# Altium project DAL_OBC_V11PrjPcb.PrjPcb (part 7 of 9)

## Sheet WATCHDOG.SchDoc
size 420 x 297 mm; SheetNumber: 20; SheetTotal: 34
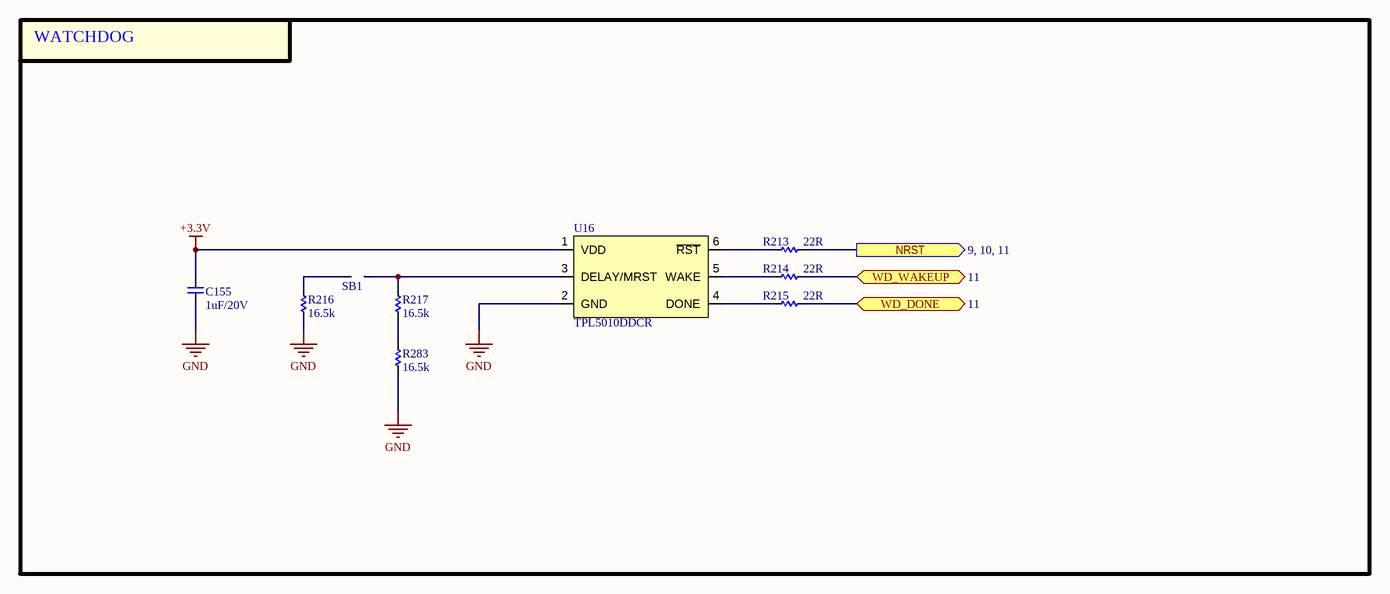
[diagram p18: WATCHDOG.SchDoc]

### Parts
C155  1uF/20V  [CAP_C_1005X50_L]
R213  22R  [RES_C_1005x30_L]
R214  22R  [RES_C_1005x30_L]
R215  22R  [RES_C_1005x30_L]
R216  16.5k  [RES_C_1005x30_L]
R217  16.5k  [RES_C_1005x30_L]
R283  16.5k  [RES_C_1005x30_L]
SB1  JUMPER  [JUMPER_1608]  (value not drawn)
U16  TPL5010DDCR  [TPL5010DDCR]

### Blocks framed on the sheet
WATCHDOG: C155 R213-R217 R283 SB1 U16

### Ports
NRST (out, see 9, 10, 11), WD_DONE (bidir, see 11), WD_WAKEUP (bidir, see 11)

### Nets
+3.3V: C155.2 U16.1(VDD)
GND: C155.1 R216.2 R283.2 U16.2(GND)  [project net AGND]
NetC75_2: R213.2 ; port NRST
NetR67_1: R214.2 ; port WD_WAKEUP
NetR111_1: R215.2 ; port WD_DONE
NetR213_1: R213.1 U16.6(~{RST})
NetR214_1: R214.1 U16.5(WAKE)
NetR215_1: R215.1 U16.4(DONE)
NetR216_1: R216.1 SB1.1
NetR217_1: R217.1 SB1.2 U16.3(DELAY/MRST)
NetR217_2: R217.2 R283.1

### Notes on the sheet
- Project:
- Sub-system:
- Design by:
- Sheet title:
- Sheet
- of
- Checked by:
- Approved by:
- Revision:
- Document No:
- Size:
- Date:
- A3

### Library data of the parts
C155 = _CAP_C_2: CAP CHIP
R213-R217 R283 = _RES_B_2: RES
U16 = TPL5010DDCR: OSC PROG TIMER TSOT23-6

## Sheet CAN_PHY.SchDoc
size 420 x 297 mm; SheetNumber: 21; SheetTotal: 34
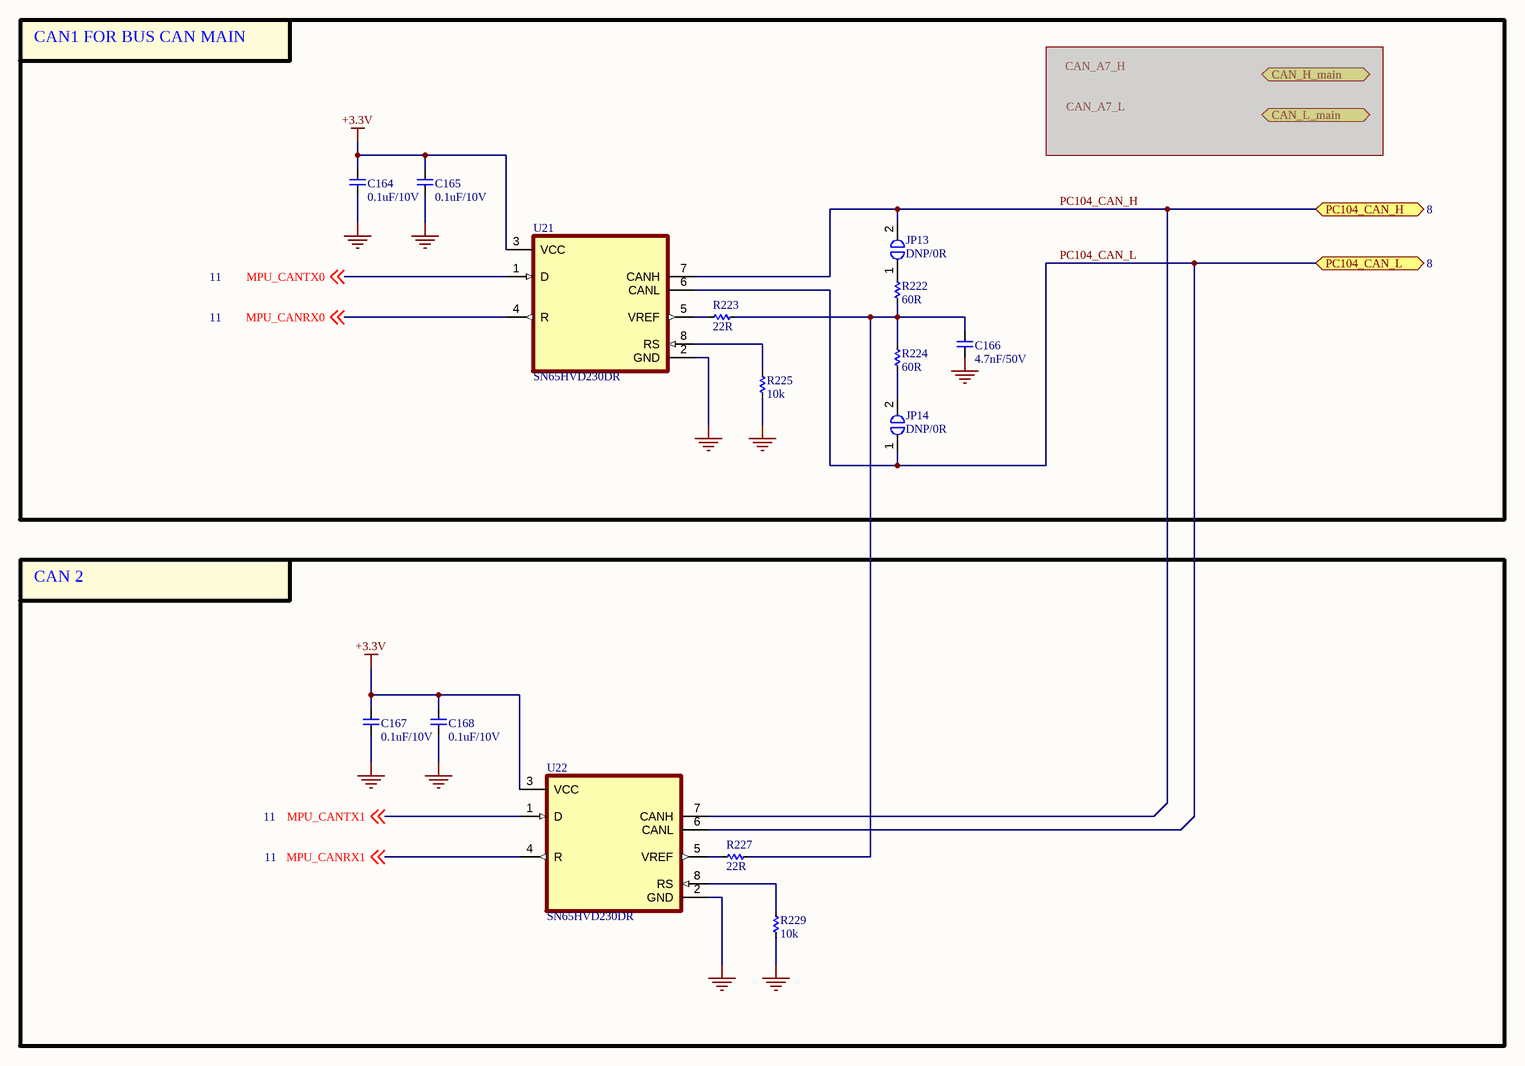
[diagram p19: CAN_PHY.SchDoc]

### Parts
C164  0.1uF/10V  [CAP_C_1005X50_L]
C165  0.1uF/10V  [CAP_C_1005X50_L]
C166  4.7nF/50V  [CAP_C_1608X80]
C167  0.1uF/10V  [CAP_C_1005X50_L]
C168  0.1uF/10V  [CAP_C_1005X50_L]
JP13  DNP/0R  [RES_C_1608X60]
JP14  DNP/0R  [RES_C_1608X60]
R222  60R  [RES_C_1005x30_L]
R223  22R  [RES_C_1005x30_L]
R224  60R  [RES_C_1005x30_L]
R225  10k  [RES_C_1005x30_L]
R227  22R  [RES_C_1005x30_L]
R229  10k  [RES_C_1005x30_L]
U21  SN65HVD230DR  [SOIC127P602X173-8N]
U22  SN65HVD230DR  [SOIC127P602X173-8N]

### Blocks framed on the sheet
CAN1 FOR BUS CAN MAIN: C164-C166 JP13 JP14 R222-R225 U21
CAN 2: C167 C168 R227 R229 U22

### Ports
CAN_H_main (bidir, see CAN_PHY[5A], CONNECTOR_EXP[4B], CONNECTOR_INTERFACE[4A]), CAN_L_main (bidir, see CAN_PHY[5A], CONNECTOR_EXP[4B], CONNECTOR_INTERFACE[4A]), PC104_CAN_H (bidir, see 8), PC104_CAN_L (bidir, see 8)

### Nets
+3.3V: C164.2 C165.2 C167.2 C168.2 U21.3(VCC) U22.3(VCC)
GND: C164.1 C165.1 C166.1 C167.1 C168.1 R225.2 R229.2 U21.2(GND) U22.2(GND)  [project net AGND]
MPU_CANRX0: U21.4(R) ; off-sheet MPU_CANRX0
MPU_CANRX1: U22.4(R) ; off-sheet MPU_CANRX1
MPU_CANTX0: U21.1(D) ; off-sheet MPU_CANTX0
MPU_CANTX1: U22.1(D) ; off-sheet MPU_CANTX1
PC104_CAN_H: JP13.2 U21.7(CANH) U22.7(CANH) ; port PC104_CAN_H
PC104_CAN_L: JP14.1 U21.6(CANL) U22.6(CANL) ; port PC104_CAN_L
NetC166_2: C166.2 R222.2 R223.1 R224.1 R227.1
NetJP13_1: JP13.1 R222.1
NetJP14_2: JP14.2 R224.2
NetR223_2: R223.2 U21.5(VREF)
NetR225_1: R225.1 U21.8(RS)
NetR227_2: R227.2 U22.5(VREF)
NetR229_1: R229.1 U22.8(RS)

### Notes on the sheet
- Project:
- Sub-system:
- Design by:
- Sheet title:
- Sheet
- of
- Checked by:
- Approved by:
- Revision:
- Document No:
- Size:
- Date:
- A3

### Library data of the parts
C164-C168 = _CAP_C_2: CAP
JP13 JP14 = JUMPER_1_1
R222-R225 R227 R229 = _RES_B_2: RES
U21 U22 = SN65HVD230DR: 3.3 V CAN Transceiver with Standby Mode; MF: Texas Instruments; SnapEDA_Link: https://www.snapeda.com/parts/SN65HVD230DR/Texas+Instruments/view-part/?ref=snap; Package: SOIC-8 Texas Instruments; Value: *; MP: SN65HVD230DR; Check_prices: https://www.snapeda.com/parts/SN65HVD230DR/Texas+Instruments/view-part/?ref=eda

## Sheet RS485.SchDoc
size 420 x 297 mm; SheetNumber: 22; SheetTotal: 34
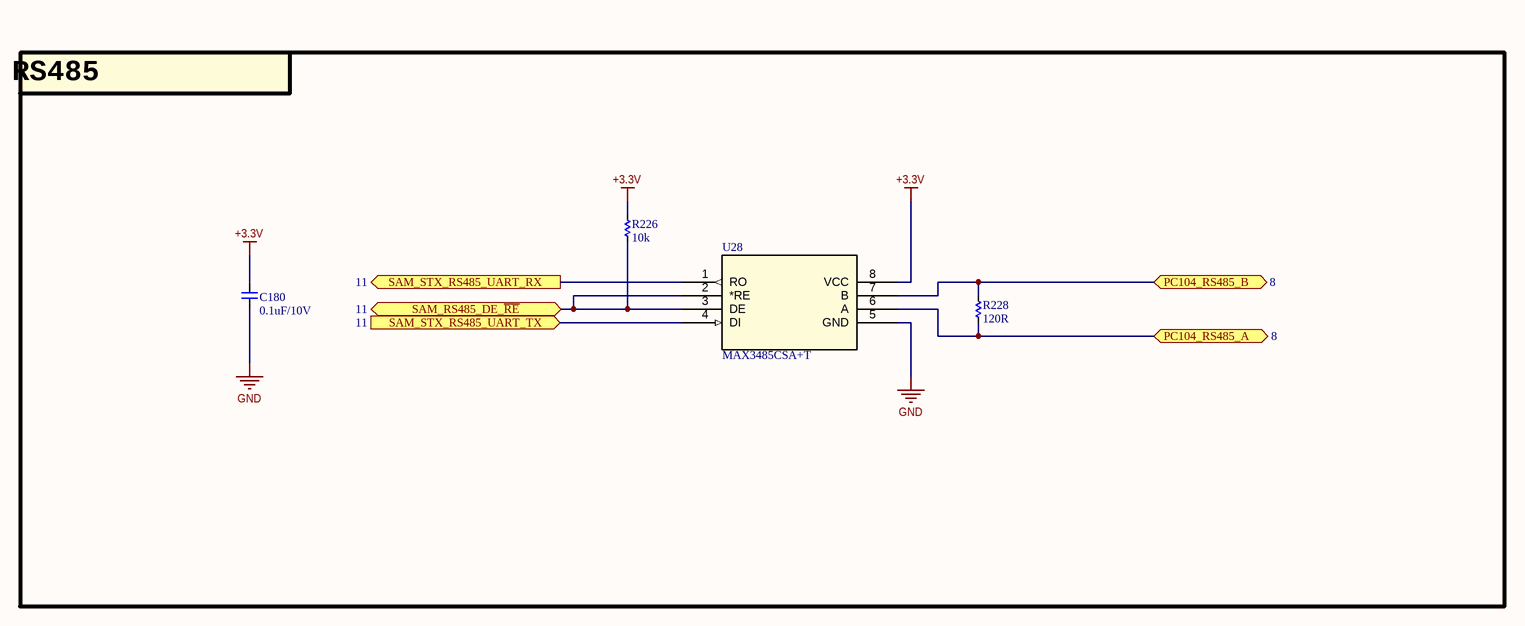
[diagram p20: RS485.SchDoc]

### Parts
C180  0.1uF/10V  [CAP_C_1005X50_L]
R226  10k  [RES_C_1005x30_L]
R228  120R  [RES_C_1005x30_L]
U28  MAX3485CSA+T  [21-0041-3-M_90-0096-8L_MXM]

### Blocks framed on the sheet
RS485: C180 R226 R228 U28

### Ports
PC104_RS485_A (bidir, see 8), PC104_RS485_B (bidir, see 8), SAM_RS485_DE_~{RE} (bidir, see 11), SAM_STX_RS485_UART_RX (out, see 11), SAM_STX_RS485_UART_TX (in, see 11)

### Nets
+3.3V: C180.2 R226.1 U28.8(VCC)
GND: C180.1 U28.5(GND)  [project net AGND]
NetH1_37: R228.1 U28.7(B) ; port PC104_RS485_B
NetH1_38: R228.2 U28.6(A) ; port PC104_RS485_A
NetR48_1: U28.4(DI) ; port SAM_STX_RS485_UART_TX
NetR51_1: U28.1(RO) ; port SAM_STX_RS485_UART_RX
NetR226_2: R226.2 U28.2(*RE) U28.3(DE) ; port SAM_RS485_DE_~{RE}

### Notes on the sheet
- Project:
- Sub-system:
- Design by:
- Sheet title:
- Sheet
- of
- Checked by:
- Approved by:
- Revision:
- Document No:
- Size:
- Date:
- A3

### Library data of the parts
C180 = _CAP_C_2: CAP
R226 R228 = _RES_B_2: RES
U28 = MAX3485CSA+T: Low-Power, Slew-Rate-Limited RS-485/RS-422 Transceivers, IC TRANSCEIVER HALF 1/1 8SOIC; Manufacturer_Name: Analog Devices Inc; Manufacturer_Part_Number: MAX485CSA+T; Copyright: Copyright (C) 2025 Ultra Librarian. All rights reserved.; RefDes: RefDes; Type: Type

## Sheet RS422.SchDoc
size 420 x 297 mm; SheetNumber: 23; SheetTotal: 34
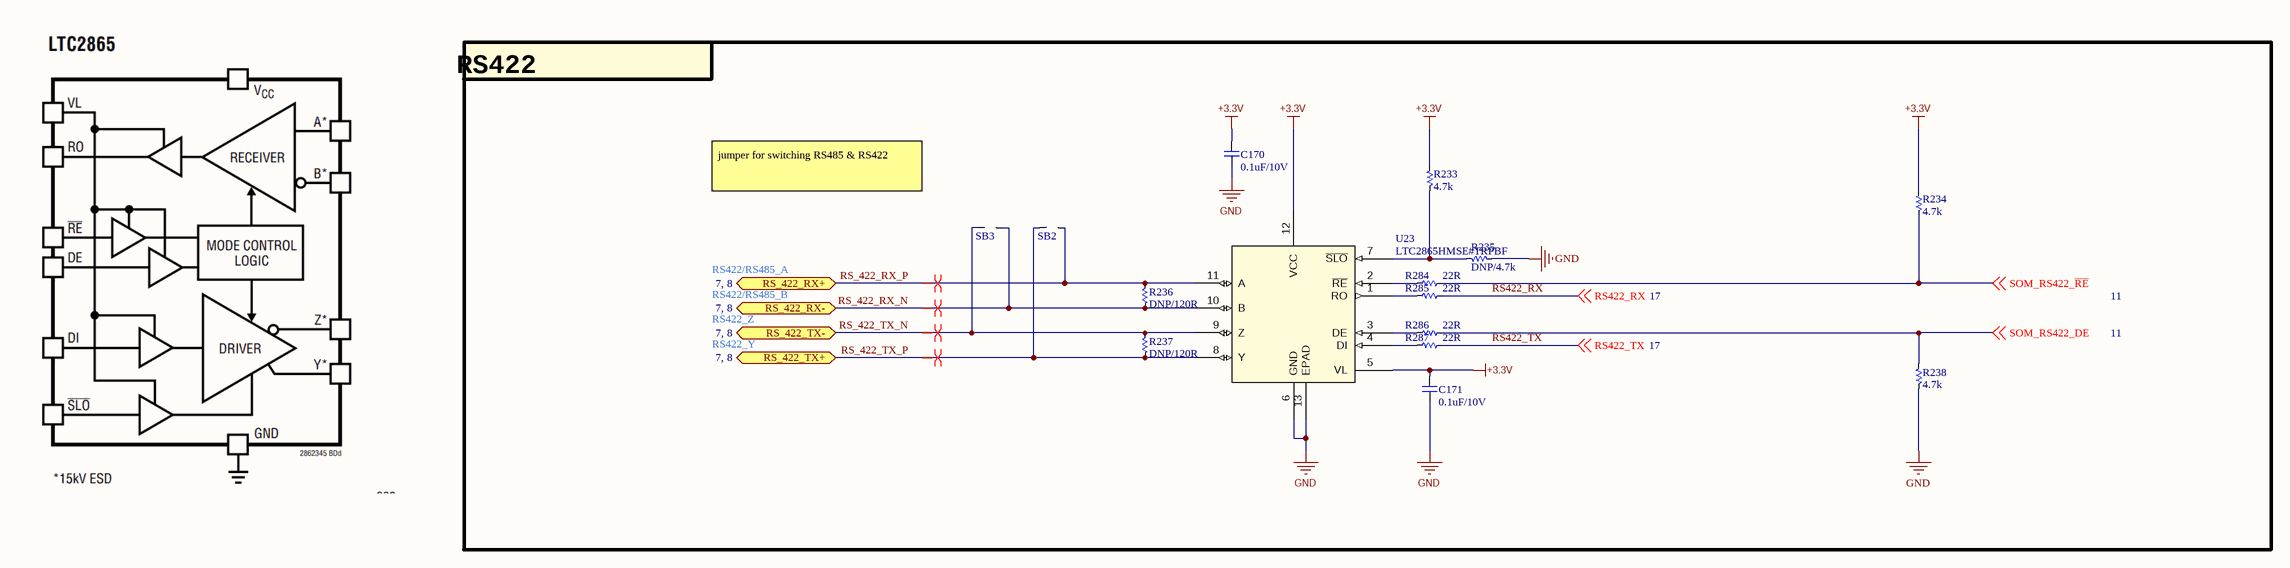
[diagram p21: RS422.SchDoc]

### Parts
C170  0.1uF/10V  [CAP_C_1005X50_L]
C171  0.1uF/10V  [CAP_C_1005X50_L]
R233  4.7k  [RES_C_1005x30_L]
R234  4.7k  [RES_C_1005x30_L]
R235  DNP/4.7k  [RES_C_1005x30_L]
R236  DNP/120R  [RES_C_1005x30_L]
R237  DNP/120R  [RES_C_1005x30_L]
R238  4.7k  [RES_C_1005x30_L]
R284  22R  [RES_C_1005x30_L]
R285  22R  [RES_C_1005x30_L]
R286  22R  [RES_C_1005x30_L]
R287  22R  [RES_C_1005x30_L]
SB2  JUMPER  [JUMPER_1608]  (value not drawn)
SB3  JUMPER  [JUMPER_1608]  (value not drawn)
U23  LTC2865HMSE#TRPBF  [MSOP-12_MSE_LIT]

### Ports
RS_422_RX+ (bidir, see 7, 8), RS_422_RX- (bidir, see 7, 8), RS_422_TX+ (bidir, see 7, 8), RS_422_TX- (bidir, see 7, 8)

### Nets
+3.3V: C170.2 C171.2 R233.2 R234.2 U23.5(VL) U23.12(VCC)
GND: C170.1 C171.1 R235.2 R238.1 U23.6(GND) U23.13(EPAD)  [project net AGND]
RS422_RX: R285.2 ; off-sheet RS422_RX
RS422_TX: R287.2 ; off-sheet RS422_TX
RS_422_RX_N: R236.2 SB3.1 U23.10(B) ; port RS_422_RX-
RS_422_RX_P: R236.1 SB2.1 U23.11(A) ; port RS_422_RX+
RS_422_TX_N: R237.1 SB3.2 U23.9(Z) ; port RS_422_TX-
RS_422_TX_P: R237.2 SB2.2 U23.8(Y) ; port RS_422_TX+
SOM_RS422_DE: R238.2 R286.2 ; off-sheet SOM_RS422_DE
SOM_RS422_~{RE}: R234.1 R284.2 ; off-sheet SOM_RS422_~{RE}
NetR233_1: R233.1 R235.1 U23.7(~{SLO})
NetR284_1: R284.1 U23.2(~{RE})
NetR285_1: R285.1 U23.1(RO)
NetR286_1: R286.1 U23.3(DE)
NetR287_1: R287.1 U23.4(DI)

### Layout directives
differential pair; net class DIFF100; differential pair class DIFF100: RS_422_RX_N, RS_422_RX_P, RS_422_TX_N, RS_422_TX_P

### Notes on the sheet
- RS422
- jumper for switching RS485 & RS422
- RS422/RS485_A
- RS422/RS485_B
- RS422_Z
- RS422_Y
- Project:
- Sub-system:
- Design by:
- Sheet title:
- Sheet
- of
- Checked by:
- Approved by:
- Revision:
- Document No:
- Size:
- Date:
- A3

### Library data of the parts
C170 C171 = _CAP_C_2: CAP
R233-R238 R284-R287 = _RES_B_2: RES
U23 = LTC2865HMSETRPBF: Â±60V Fault Protected 3V to 5.5V RS485/RS422 Transceivers; Manufacturer_Name: Analog Devices Inc; Copyright: Copyright (C) 2025 Ultra Librarian. All rights reserved.; Manufacturer_Part_Number: LTC2865HMSE#TRPBF; RefDes: RefDes; Type: Type

## Sheet RS232.SchDoc
size 420 x 297 mm; SheetNumber: 24; SheetTotal: 34
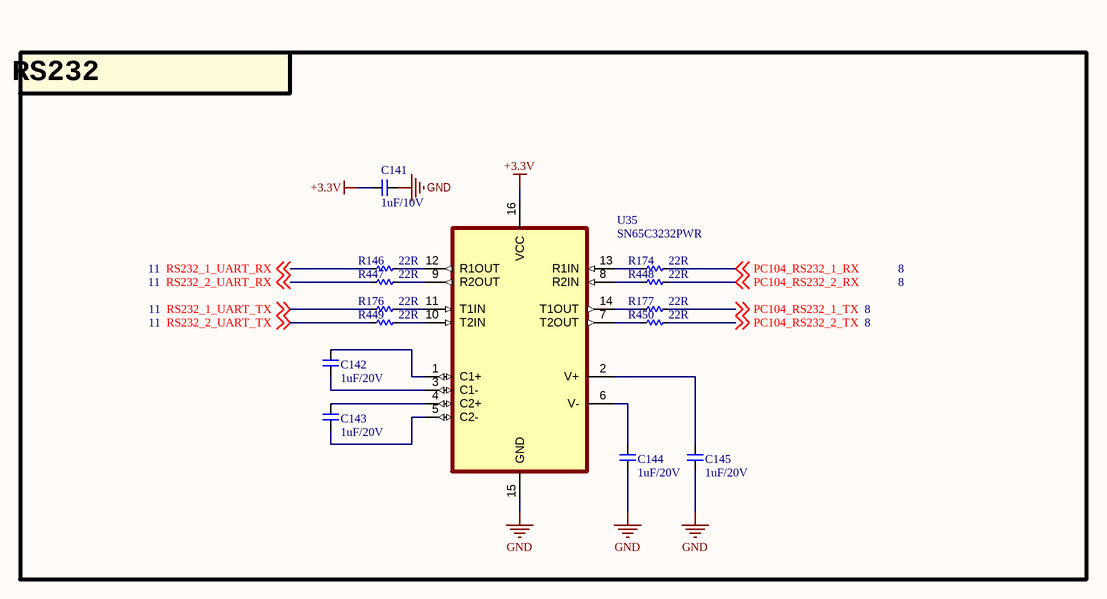
[diagram p22: RS232.SchDoc]

### Parts
C141  1uF/10V  [CAP_C_1005X50_L]
C142  1uF/20V  [CAP_C_1005X50_L]
C143  1uF/20V  [CAP_C_1005X50_L]
C144  1uF/20V  [CAP_C_1005X50_L]
C145  1uF/20V  [CAP_C_1005X50_L]
R146  22R  [RES_C_1005x30_L]
R174  22R  [RES_C_1005x30_L]
R176  22R  [RES_C_1005x30_L]
R177  22R  [RES_C_1005x30_L]
R447  22R  [RES_C_1005x30_L]
R448  22R  [RES_C_1005x30_L]
R449  22R  [RES_C_1005x30_L]
R450  22R  [RES_C_1005x30_L]
U35  SN65C3232PWR  [SOP65P640X120-16N]

### Blocks framed on the sheet
RS232: C141-C145 R146 R174 R176 R177 R447-R450 U35

### Nets
+3.3V: C141.2 U35.16(VCC)
GND: C141.1 C144.1 C145.1 U35.15(GND)  [project net AGND]
PC104_RS232_1_RX: R174.2 ; off-sheet PC104_RS232_1_RX
PC104_RS232_1_TX: R177.2 ; off-sheet PC104_RS232_1_TX
PC104_RS232_2_RX: R448.2 ; off-sheet PC104_RS232_2_RX
PC104_RS232_2_TX: R450.2 ; off-sheet PC104_RS232_2_TX
RS232_1_UART_RX: R146.1 ; off-sheet RS232_1_UART_RX
RS232_1_UART_TX: R176.1 ; off-sheet RS232_1_UART_TX
RS232_2_UART_RX: R447.1 ; off-sheet RS232_2_UART_RX
RS232_2_UART_TX: R449.1 ; off-sheet RS232_2_UART_TX
NetC142_1: C142.1 U35.1(C1+)
NetC142_2: C142.2 U35.3(C1-)
NetC143_1: C143.1 U35.4(C2+)
NetC143_2: C143.2 U35.5(C2-)
NetC144_2: C144.2 U35.6(V-)
NetC145_2: C145.2 U35.2(V+)
NetR146_2: R146.2 U35.12(R1OUT)
NetR174_1: R174.1 U35.13(R1IN)
NetR176_2: R176.2 U35.11(T1IN)
NetR177_1: R177.1 U35.14(T1OUT)
NetR447_2: R447.2 U35.9(R2OUT)
NetR448_1: R448.1 U35.8(R2IN)
NetR449_2: R449.2 U35.10(T2IN)
NetR450_1: R450.1 U35.7(T2OUT)

### Notes on the sheet
- Project:
- Sub-system:
- Design by:
- Sheet title:
- Sheet
- of
- Checked by:
- Approved by:
- Revision:
- Document No:
- Size:
- Date:
- A3

### Library data of the parts
C141-C145 = _CAP_C_2: CAP CHIP
R146 R174 R176 R177 R447-R450 = _RES_B_2: RES
U35 = IC_RS232_SN65C3232PWR: 2/2 Transceiver Full RS232 16-TSSOP 1GHz; MF: Analog Devices; MP: MAX3232CSE+T; SnapEDA_Link: https://www.snapeda.com/parts/MAX3232CSE+T/Analog+Devices/view-part/?ref=snap; Package: SOIC-16 Maxim Integrated; Value: *; Check_prices: https://www.snapeda.com/parts/MAX3232CSE+T/Analog+Devices/view-part/?ref=eda

## Sheet BUTTON_LED.SchDoc
size 420 x 297 mm; SheetNumber: 25; SheetTotal: 34
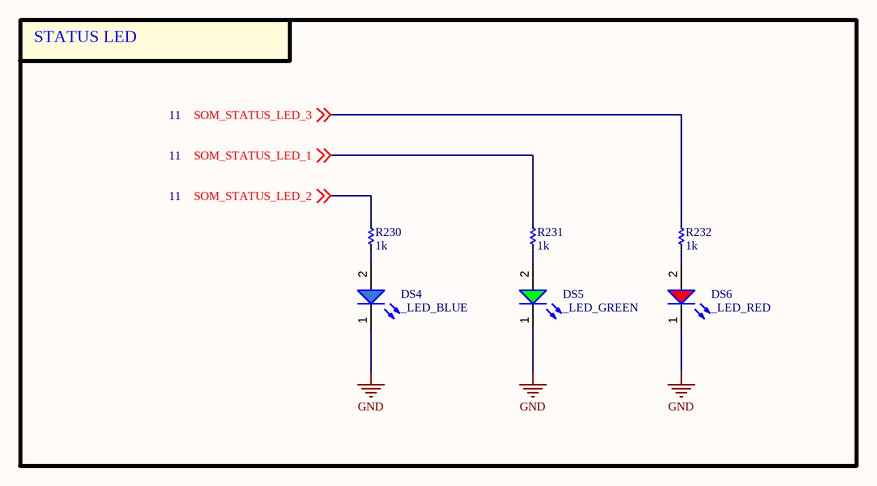
[diagram p23: BUTTON_LED.SchDoc]

### Parts
DS4  _LED_BLUE  [LED_0603]
DS5  _LED_GREEN  [LED_0603]
DS6  _LED_RED  [LED_0603]
R230  1k  [RES_C_1005x30_L]
R231  1k  [RES_C_1005x30_L]
R232  1k  [RES_C_1005x30_L]

### Blocks framed on the sheet
STATUS LED: DS4-DS6 R230-R232

### Nets
GND: DS4.1(K) DS5.1(K) DS6.1(K)  [project net AGND]
SOM_STATUS_LED_1: R231.2 ; off-sheet SOM_STATUS_LED_1
SOM_STATUS_LED_2: R230.2 ; off-sheet SOM_STATUS_LED_2
SOM_STATUS_LED_3: R232.2 ; off-sheet SOM_STATUS_LED_3
NetDS4_2: DS4.2(A) R230.1
NetDS5_2: DS5.2(A) R231.1
NetDS6_2: DS6.2(A) R232.1

### Notes on the sheet
- Project:
- Sub-system:
- Design by:
- Sheet title:
- Sheet
- of
- Checked by:
- Approved by:
- Revision:
- Document No:
- Size:
- Date:
- A3

### Library data of the parts
DS4 = LED_BLUE: LED BLUE CLEAR 0603 SMD
DS5 = LED_GREEN: LED GREEN CLEAR 0603 SMD
DS6 = LED_RED: LED RED CLEAR 0603 SMD
R230-R232 = _RES_B_2: RES

## Sheet MOUNTING_HOLE.SchDoc
size 420 x 297 mm; SheetNumber: 26; SheetTotal: 34
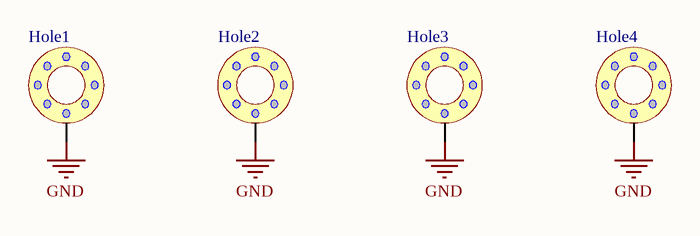
[diagram p24: MOUNTING_HOLE.SchDoc]

### Parts
Hole1  hole_space  [HEX-M3_NoVia]  (value not drawn)
Hole2  hole_space  [HEX-M3_NoVia]  (value not drawn)
Hole3  hole_space  [HEX-M3_NoVia]  (value not drawn)
Hole4  hole_space  [HEX-M3_NoVia]  (value not drawn)

### Nets
GND: Hole1.1 Hole2.1 Hole3.1 Hole4.1  [project net AGND]

### Notes on the sheet
- Project:
- Sub-system:
- Design by:
- Sheet title:
- Sheet
- of
- Checked by:
- Approved by:
- Revision:
- Document No:
- Size:
- Date:
- A3

## Sheet FPGA_POWER.SchDoc
size 420 x 297 mm; SheetNumber: 27; SheetTotal: 34
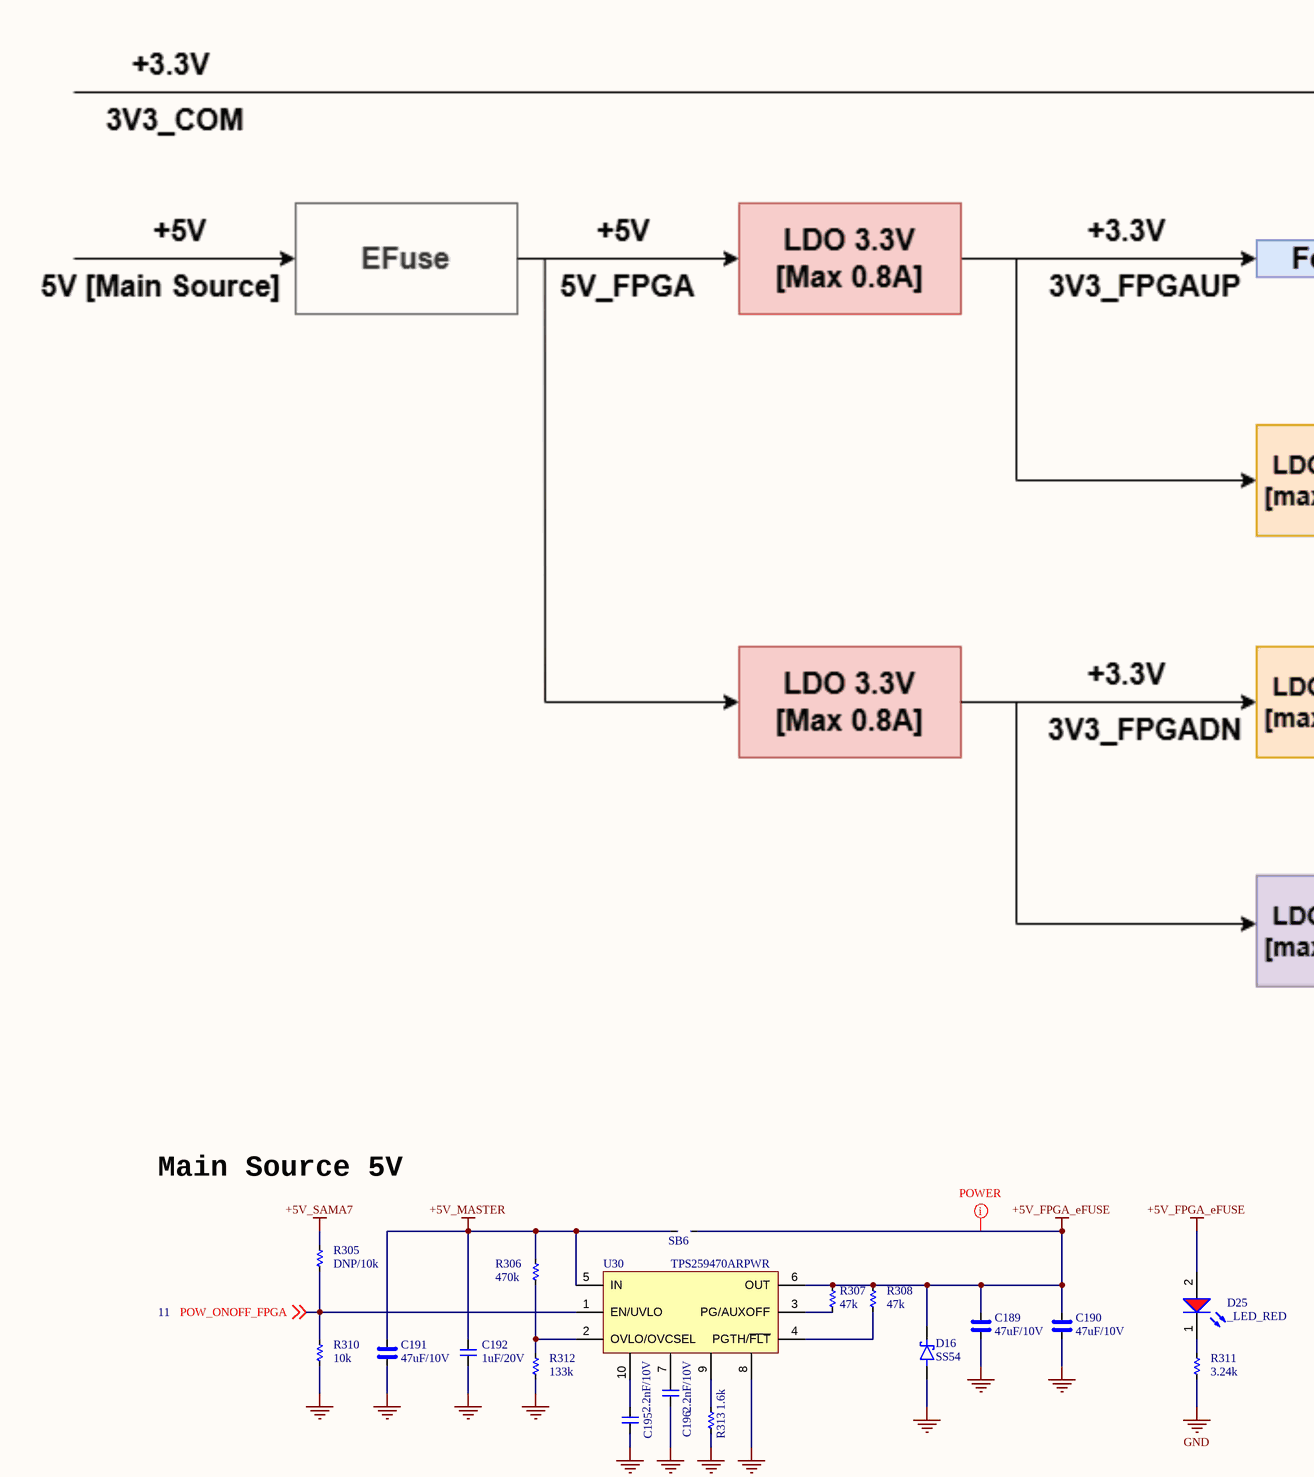
[diagram p25: FPGA_POWER.SchDoc, top left]
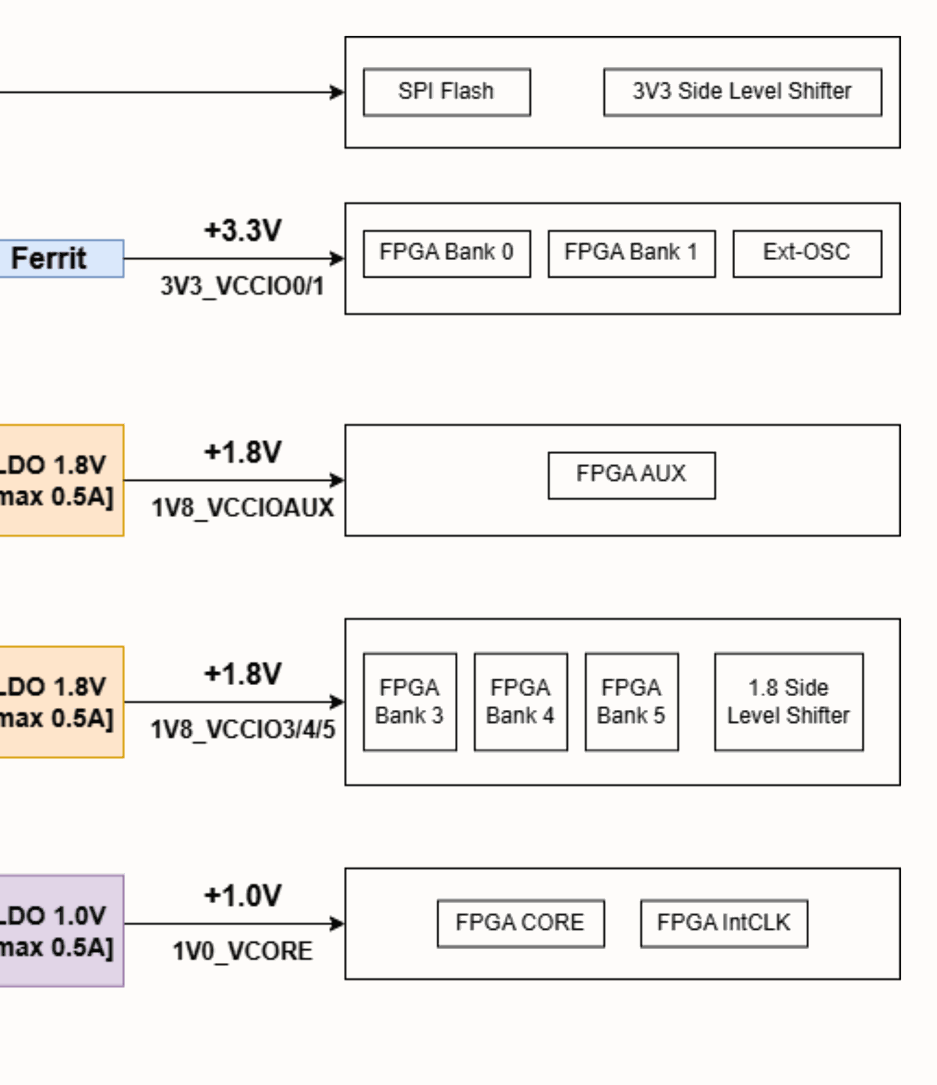
[diagram p26: FPGA_POWER.SchDoc, top right]
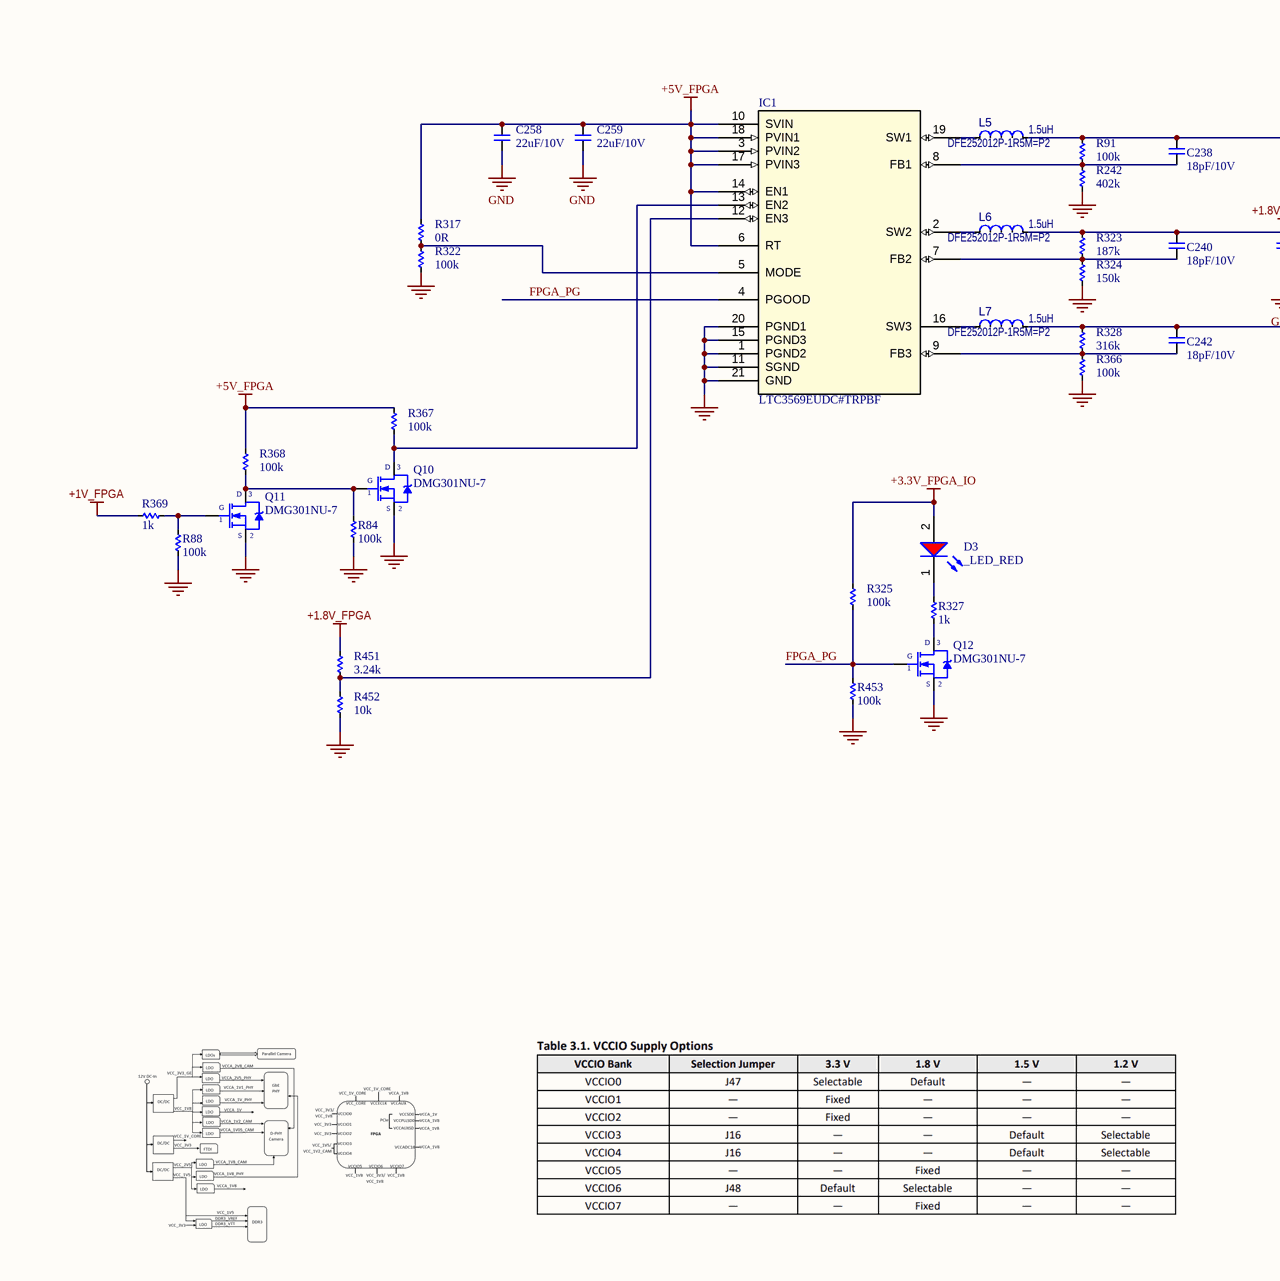
[diagram p27: FPGA_POWER.SchDoc, bottom left]
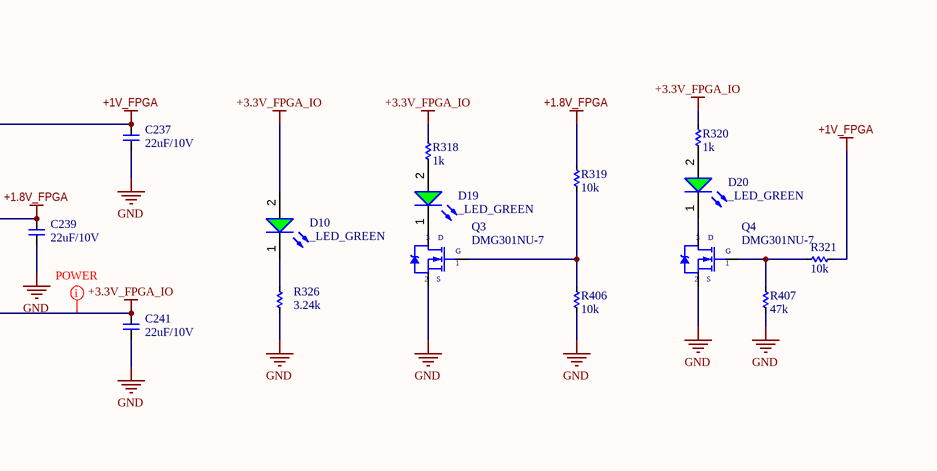
[diagram p28: FPGA_POWER.SchDoc, bottom right]

### Parts
C189  47uF/10V  [CAP_C_3225X80]
C190  47uF/10V  [CAP_C_3225X80]
C191  47uF/10V  [CAP_C_3225X80]
C192  1uF/20V  [CAP_C_1005X50_L]
C195  2.2nF/10V  [CAP_C_1005X50_L]
C196  2.2nF/10V  [CAP_C_1005X50_L]
C237  22uF/10V  [CAP_C_1608X80]
C238  18pF/10V  [CAP_C_1005X50_L]
C239  22uF/10V  [CAP_C_1608X80]
C240  18pF/10V  [CAP_C_1005X50_L]
C241  22uF/10V  [CAP_C_1608X80]
C242  18pF/10V  [CAP_C_1005X50_L]
C258  22uF/10V  [CAP_C_1608X80]
C259  22uF/10V  [CAP_C_1608X80]
D3  _LED_RED  [LED_0603]
D10  _LED_GREEN  [LED_0603]
D16  SS54  [DO-214AC_SMA]
D19  _LED_GREEN  [LED_0603]
D20  _LED_GREEN  [LED_0603]
D25  _LED_RED  [LED_0603]
IC1  LTC3569EUDC#TRPBF  [QFN20_UDC_3X4_ADI]
L5  value 1.5uH  [IND_C_1008]  (hidden comment: DFE252012P-1R5M=P2)
L6  value 1.5uH  [IND_C_1008]  (hidden comment: DFE252012P-1R5M=P2)
L7  value 1.5uH  [IND_C_1008]  (hidden comment: DFE252012P-1R5M=P2)
Q3  DMG301NU-7  [SOT95P240X120-3N]
Q4  DMG301NU-7  [SOT95P240X120-3N]
Q10  DMG301NU-7  [SOT95P240X120-3N]
Q11  DMG301NU-7  [SOT95P240X120-3N]
Q12  DMG301NU-7  [SOT95P240X120-3N]
R84  100k  [RES_C_1005x30_L]
R88  100k  [RES_C_1005x30_L]
R91  100k  [RES_C_1005x30_L]
R242  402k  [RES_C_1005x30_L]
R305  DNP/10k  [RES_C_1005x30_L]
R306  470k  [RES_C_1005x30_L]
R307  47k  [RES_C_1005x30_L]
R308  47k  [RES_C_1005x30_L]
R310  10k  [RES_C_1005x30_L]
R311  3.24k  [RES_C_1005x30_L]
R312  133k  [RES_C_1005x30_L]
R313  1.6k  [RES_C_1005x30_L]
R317  0R  [RES_C_1005x30_L]
R318  1k  [RES_C_1005x30_L]
R319  10k  [RES_C_1005x30_L]
R320  1k  [RES_C_1005x30_L]
R321  10k  [RES_C_1005x30_L]
R322  100k  [RES_C_1005x30_L]
R323  187k  [RES_C_1005x30_L]
R324  150k  [RES_C_1005x30_L]
R325  100k  [RES_C_1005x30_L]
R326  3.24k  [RES_C_1005x30_L]
R327  1k  [RES_C_1005x30_L]
R328  316k  [RES_C_1005x30_L]
R366  100k  [RES_C_1005x30_L]
R367  100k  [RES_C_1005x30_L]
R368  100k  [RES_C_1005x30_L]
R369  1k  [RES_C_1005x30_L]
R406  10k  [RES_C_1005x30_L]
R407  47k  [RES_C_1005x30_L]
R451  3.24k  [RES_C_1005x30_L]
R452  10k  [RES_C_1005x30_L]
R453  100k  [RES_C_1005x30_L]
SB6  JUMPER  [JUMPER_1608]  (value not drawn)
U30  TPS259470ARPWR  [VQFN-HR-10]

### Nets
+1.8V_FPGA: C239.1 C240.1 L6.2(F) R319.1 R323.2 R451.2
+1V_FPGA: C237.1 C238.1 L5.2(F) R91.2 R321.1 R369.2
+3.3V_FPGA_IO: C241.1 C242.1 D3.2(A) D10.2(A) L7.2(F) R318.2 R320.2 R325.2 R328.2
+5V_FPGA: C258.1 C259.1 IC1.3(PVIN2) IC1.6(RT) IC1.10(SVIN) IC1.14(EN1) IC1.17(PVIN3) IC1.18(PVIN1) R317.2 R367.2 R368.2
+5V_FPGA_eFUSE: C189.2 C190.2 D16.1(K) D25.2(A) R307.2 R308.2 SB6.2 U30.6(OUT)
+5V_MASTER: C191.2 C192.2 R306.2 SB6.1 U30.5(IN)
+5V_SAMA7: R305.1
GND: C189.1 C190.1 C191.1 C192.1 C195.1 C196.1 C237.2 C239.2 C241.2 C258.2 C259.2 D16.2(A) IC1.1(PGND2) IC1.11(SGND) IC1.15(PGND3) IC1.20(PGND1) IC1.21(GND) Q3.2(S) Q4.2(S) Q10.2(S) Q11.2(S) Q12.2(S) R84.2 R88.2 R242.1 R310.2 R311.1 R312.1 R313.1 R322.1 R324.1 R326.1 R366.1 R406.2 R407.1 R452.1 R453.2 U30.8  [project net AGND]
FPGA_PG: IC1.4(PGOOD) Q12.1(G) R325.1 R453.1
POW_ONOFF_FPGA: R305.2 R310.1 U30.1(EN/UVLO) ; off-sheet POW_ONOFF_FPGA
NetC195_2: C195.2 U30.10
NetC196_2: C196.2 U30.7
NetC238_2: C238.2 IC1.8(FB1) R91.1 R242.2
NetC240_2: C240.2 IC1.7(FB2) R323.1 R324.2
NetC242_2: C242.2 IC1.9(FB3) R328.1 R366.2
NetD3_1: D3.1(K) R327.2
NetD10_1: D10.1(K) R326.2
NetD19_1: D19.1(K) Q3.3(D)
NetD19_2: D19.2(A) R318.1
NetD20_1: D20.1(K) Q4.3(D)
NetD20_2: D20.2(A) R320.1
NetD25_1: D25.1(K) R311.2
NetIC1_2: IC1.2(SW2) L6.1(S)
NetIC1_5: IC1.5(MODE) R317.1 R322.2
NetIC1_12: IC1.12(EN3) R451.1 R452.2
NetIC1_13: IC1.13(EN2) Q10.3(D) R367.1
NetIC1_16: IC1.16(SW3) L7.1(S)
NetIC1_19: IC1.19(SW1) L5.1(S)
NetQ3_1: Q3.1(G) R319.2 R406.1
NetQ4_1: Q4.1(G) R321.2 R407.2
NetQ10_1: Q10.1(G) Q11.3(D) R84.1 R368.1
NetQ11_1: Q11.1(G) R88.1 R369.1
NetQ12_3: Q12.3(D) R327.1
NetR306_1: R306.1 R312.2 U30.2(OVLO/OVCSEL)
NetR307_1: R307.1 U30.3(PG/AUXOFF)
NetR308_1: R308.1 U30.4(PGTH/~{FLT})
NetR313_2: R313.2 U30.9

### Layout directives
net class POWER: +3.3V_FPGA_IO, +5V_FPGA_eFUSE

### Notes on the sheet
- Main Source 5V
- Project:
- Sub-system:
- Design by:
- Sheet title:
- Sheet
- of
- Checked by:
- Approved by:
- Revision:
- Document No:
- Size:
- Date:
- A3

### Library data of the parts
C189-C191 = _CAP_C_High_2: CAP CHIP High Value
C192 C195 C196 = _CAP_C_2: CAP CHIP
C237-C242 C258 C259 = _CAP_C_2: CAP
D3 D25 = LED_RED: LED RED CLEAR 0603 SMD
D10 D19 D20 = LED_GREEN: LED GREEN CLEAR 0603 SMD
D16 = DIODE SCHOTTKY
IC1 = LTC3569EUDCTRPBF: Triple Buck Regulator with 1.2A and Two 600mA Outputs and Individual Programmable References; Manufacturer_Name: Analog Devices Inc; Copyright: Copyright (C) 2025 Ultra Librarian. All rights reserved.; Manufacturer_Part_Number: LTC3569EUDC#TRPBF; RefDes: RefDes; Type: Type
L5-L7 = IND1335: Inductor; Manufacturer 1: Murata Electronics North America; Description_: INDUCTOR 1.5uH 3.5A 20% SMD 1008; Dev Tools Status: Design; Owner: Razvan Cristescu; DCR: 0.06R; RMS Current: 3.5A; Test Frequency: 1MHz; Populated: YES; MCHP-ID: IND1335; Revision: A; Symbol: Inductor; Status: MCL Design; ComponentLink1URL: https://chn-vm-apps.microchip.com/mchprepo/parts/Datasheets/m_dfe252012p.pdf; ComponentLink1Description: SVN Datasheet; ComponentLink2URL: C:\ALTIUM_WORK\00001_MCHP-CDB\Datasheets\m_dfe252012p.pdf; ComponentLink2Description: Local Datasheet; ComponentLink3URL: C:\ALTIUM_WORK\00001_MCHP-CDB\Library\LibraryRefs\Inductor.SchLib; ComponentLink3Description: Open Symbol; ComponentLink4URL: C:\ALTIUM_WORK\00001_MCHP-CDB\Library\Footprints\IND_C_1008.PcbLib; ComponentLink4Description: Open Footprint; ComponentLink5Description: Open Footprint 2; ComponentLink6Description: Open Footprint 3; ComponentLink7Description: Open Footprint 4; Package: 1008; Type: Inductor; Category: Inductor; Manufacturer Part Number 1: DFE252012P-1R5M=P2; Supplier 1: Digi-Key; Supplier Part Number 1: 490-10648-6-ND; Quantity Override: 1
Q3 Q4 Q10-Q12 = MOSFET_N_GSD
R84 R88 R91 R242 R305-R308 R310-R313 R317-R328 R366-R369 R406 R407 R451-R453 = _RES_B_2: RES

## Sheet FPGA_POWER_2.SchDoc
size 420 x 297 mm; SheetNumber: 28; SheetTotal: 34
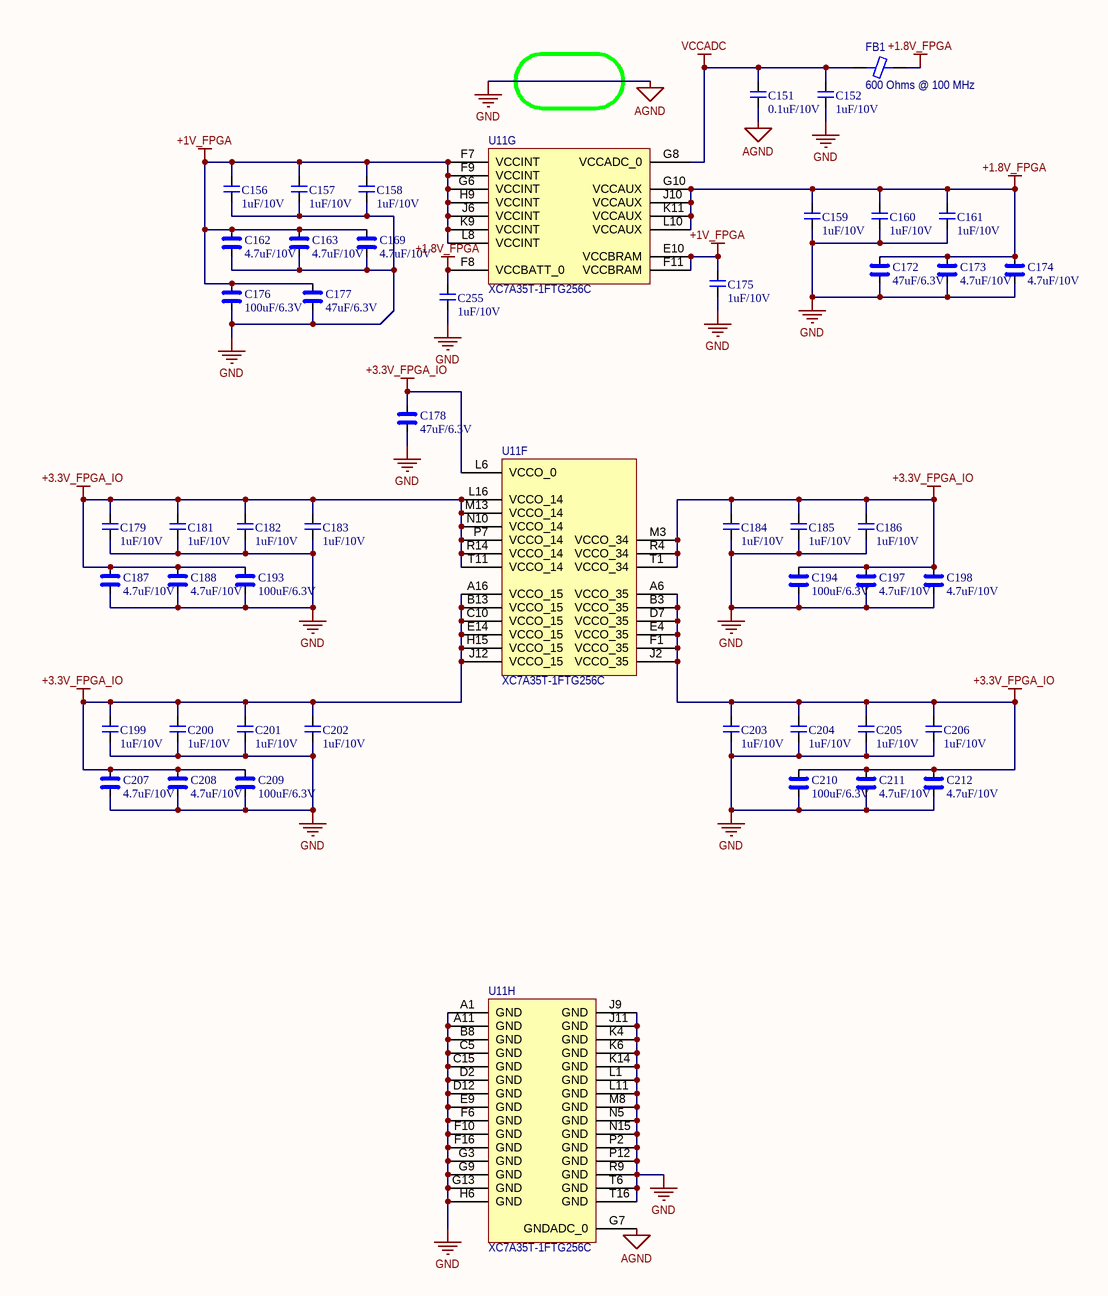
[diagram p29: FPGA_POWER_2.SchDoc]

### Parts
C151  0.1uF/10V  [CAP_C_1005X50_L]
C152  1uF/10V  [CAP_C_1005X50_L]
C156  1uF/10V  [CAP_C_1005X50_L]
C157  1uF/10V  [CAP_C_1005X50_L]
C158  1uF/10V  [CAP_C_1005X50_L]
C159  1uF/10V  [CAP_C_1005X50_L]
C160  1uF/10V  [CAP_C_1005X50_L]
C161  1uF/10V  [CAP_C_1005X50_L]
C162  4.7uF/10V  [CAP_C_1005X50_L]
C163  4.7uF/10V  [CAP_C_1005X50_L]
C169  4.7uF/10V  [CAP_C_1005X50_L]
C172  47uF/6.3V  [CAP_C_1608X80]
C173  4.7uF/10V  [CAP_C_1005X50_L]
C174  4.7uF/10V  [CAP_C_1005X50_L]
C175  1uF/10V  [CAP_C_1005X50_L]
C176  100uF/6.3V  [CAP_C_2012X110]
C177  47uF/6.3V  [CAP_C_1608X80]
C178  47uF/6.3V  [CAP_C_1608X80]
C179  1uF/10V  [CAP_C_1005X50_L]
C181  1uF/10V  [CAP_C_1005X50_L]
C182  1uF/10V  [CAP_C_1005X50_L]
C183  1uF/10V  [CAP_C_1005X50_L]
C184  1uF/10V  [CAP_C_1005X50_L]
C185  1uF/10V  [CAP_C_1005X50_L]
C186  1uF/10V  [CAP_C_1005X50_L]
C187  4.7uF/10V  [CAP_C_1005X50_L]
C188  4.7uF/10V  [CAP_C_1005X50_L]
C193  100uF/6.3V  [CAP_C_2012X110]
C194  100uF/6.3V  [CAP_C_2012X110]
C197  4.7uF/10V  [CAP_C_1005X50_L]
C198  4.7uF/10V  [CAP_C_1005X50_L]
C199  1uF/10V  [CAP_C_1005X50_L]
C200  1uF/10V  [CAP_C_1005X50_L]
C201  1uF/10V  [CAP_C_1005X50_L]
C202  1uF/10V  [CAP_C_1005X50_L]
C203  1uF/10V  [CAP_C_1005X50_L]
C204  1uF/10V  [CAP_C_1005X50_L]
C205  1uF/10V  [CAP_C_1005X50_L]
C206  1uF/10V  [CAP_C_1005X50_L]
C207  4.7uF/10V  [CAP_C_1005X50_L]
C208  4.7uF/10V  [CAP_C_1005X50_L]
C209  100uF/6.3V  [CAP_C_2012X110]
C210  100uF/6.3V  [CAP_C_2012X110]
C211  4.7uF/10V  [CAP_C_1005X50_L]
C212  4.7uF/10V  [CAP_C_1005X50_L]
C255  1uF/10V  [CAP_C_1005X50_L]
FB1  600 Ohms @ 100 MHz  [IND_C_1608X60]
U11  XC7A35T-1FTG256C  [FTG256]  (parts F,G,H of 8)

### Nets
+1.8V_FPGA: C159.1 C160.1 C161.1 C172.1 C173.1 C174.1 C255.1 FB1.2 U11.F8(VCCBATT_0) U11.G10(VCCAUX) U11.J10(VCCAUX) U11.K11(VCCAUX) U11.L10(VCCAUX)
+1V_FPGA: C156.1 C157.1 C158.1 C162.1 C163.1 C169.1 C175.1 C176.1 C177.1 U11.E10(VCCBRAM) U11.F7(VCCINT) U11.F9(VCCINT) U11.F11(VCCBRAM) U11.G6(VCCINT) U11.H9(VCCINT) U11.J6(VCCINT) U11.K9(VCCINT) U11.L8(VCCINT)
+3.3V_FPGA_IO: C178.1 C179.1 C181.1 C182.1 C183.1 C184.1 C185.1 C186.1 C187.1 C188.1 C193.1 C194.1 C197.1 C198.1 C199.1 C200.1 C201.1 C202.1 C203.1 C204.1 C205.1 C206.1 C207.1 C208.1 C209.1 C210.1 C211.1 C212.1 U11.A6(VCCO_35) U11.A16(VCCO_15) U11.B3(VCCO_35) U11.B13(VCCO_15) U11.C10(VCCO_15) U11.D7(VCCO_35) U11.E4(VCCO_35) U11.E14(VCCO_15) U11.F1(VCCO_35) U11.H15(VCCO_15) U11.J2(VCCO_35) U11.J12(VCCO_15) U11.L6(VCCO_0) U11.L16(VCCO_14) U11.M3(VCCO_34) U11.M13(VCCO_14) U11.N10(VCCO_14) U11.P7(VCCO_14) U11.R4(VCCO_34) U11.R14(VCCO_14) U11.T1(VCCO_34) U11.T11(VCCO_14)
AGND: C151.2 C152.2 C156.2 C157.2 C158.2 C159.2 C160.2 C161.2 C162.2 C163.2 C169.2 C172.2 C173.2 C174.2 C175.2 C176.2 C177.2 C178.2 C179.2 C181.2 C182.2 C183.2 C184.2 C185.2 C186.2 C187.2 C188.2 C193.2 C194.2 C197.2 C198.2 C199.2 C200.2 C201.2 C202.2 C203.2 C204.2 C205.2 C206.2 C207.2 C208.2 C209.2 C210.2 C211.2 C212.2 C255.2 U11.A1(GND) U11.A11(GND) U11.B8(GND) U11.C5(GND) U11.C15(GND) U11.D2(GND) U11.D12(GND) U11.E9(GND) U11.F6(GND) U11.F10(GND) U11.F16(GND) U11.G3(GND) U11.G7(GNDADC_0) U11.G9(GND) U11.G13(GND) U11.H6(GND) U11.J9(GND) U11.J11(GND) U11.K4(GND) U11.K6(GND) U11.K14(GND) U11.L1(GND) U11.L11(GND) U11.M8(GND) U11.N5(GND) U11.N15(GND) U11.P2(GND) U11.P12(GND) U11.R9(GND) U11.T6(GND) U11.T16(GND)  [also labelled GND]
VCCADC: C151.1 C152.1 FB1.1 U11.G8(VCCADC_0)

### Notes on the sheet
- Project:
- Sub-system:
- Design by:
- Sheet title:
- Sheet
- of
- Checked by:
- Approved by:
- Revision:
- Document No:
- Size:
- Date:
- A3

### Library data of the parts
C151 C152 C156-C161 C175 C179 C181-C186 C199-C206 C255 = _CAP_C_2: CAP
C162 C163 C169 C172-C174 C176-C178 C187 C188 C193 C194 C197 C198 C207-C212 = _CAP_C_High_2: CAP
FB1 = BLM18AG601SN1D: FERRITE BEAD 600 OHM 0603 1LN; Manufacturer: Murata Electronics; Current Rating (Max): 500mA; DC Resistance (DCR) (Max): 380mOhm; Number of Lines: 1; Part Number: BLM18AG601SN1D; ComponentLink1Description: Datasheet; ComponentLink1URL: https://www.murata.com/en-us/products/productdata/8796738650142/ENFA0003.pdf; ComponentLink2Description: DigiKey Link; ComponentLink2URL: https://www.digikey.com/en/products/detail/murata-electronics/BLM18AG601SN1D/584225; Device Package: 0603 (1608 Metric); Height (Max): 0.037" (0.95mm); Impedance @ Frequency: 600 Ohms @ 100 MHz; LastUpdated: 7/10/2022 9:43:27 AM; Lifecycle Status: Active; Minimum Order: 1; Mounting Type: Surface Mount; Operating Temperature: -55°C ~ 125°C; Package / Case: 0603 (1608 Metric); Packaging: TapeAndReel; PartId: 848; Part Status: Active; Price: 0.02; Series: EMIFIL®, BLM18; Size / Dimension: 0.063" L x 0.032" W (1.60mm x 0.80mm); Supplier 1: DigiKey; Supplier Part Number 1: 490-1014-1-ND; Value: 600 Ohms @ 100 MHz
U11 = CMP-0383-00028-1: Artix-7 FPGA, 170 User I/Os, 0 GTP, 256-Ball BGA, Speed Grade 1, Commercial Grade, Pb-Free; Manufacturer: Xilinx; Speed Grades: 1; Total Block RAM: 1800 Kb; CMTs: 5; GTP: 0; Available User I/O: 170; Logic Cells: 33280; ComponentLink2Description: Datasheet; ComponentLink2URL: http://www.xilinx.com/support/documentation/data_sheets/ds180_7Series_Overview.pdf; ComponentLink1Description: Manufacturer URL; Operating Temperature Range: Commercial; PackageVersion: Rev. 1.11; ComponentLink4URL: http://www.xilinx.com/support/documentation/user_guides/ug475_7Series_Pkg_Pinout.pdf; ComponentLink4Description: Package Specification; PackageDescription: 256-Ball Wire-Bond Fine-Pitch Thin BGA, Body 17 x 17 mm, Pitch 1 mm; Mounting Technology: Surface Mount; ComponentLink1URL: http://www.xilinx.com/; Maximum Distributed RAM: 400 Kb; PackageReference: FTG-256; DatasheetVersion: Rev. 1.15; ComponentLink3Description: Pinout; PartNumber: XC7A35T-1FTG256C; ComponentLink3URL: http://www.xilinx.com/support/documentation/user_guides/ug475_7Series_Pkg_Pinout.pdf